# Altium project CMSIS-DAP_11U37_V100.PrjPCB
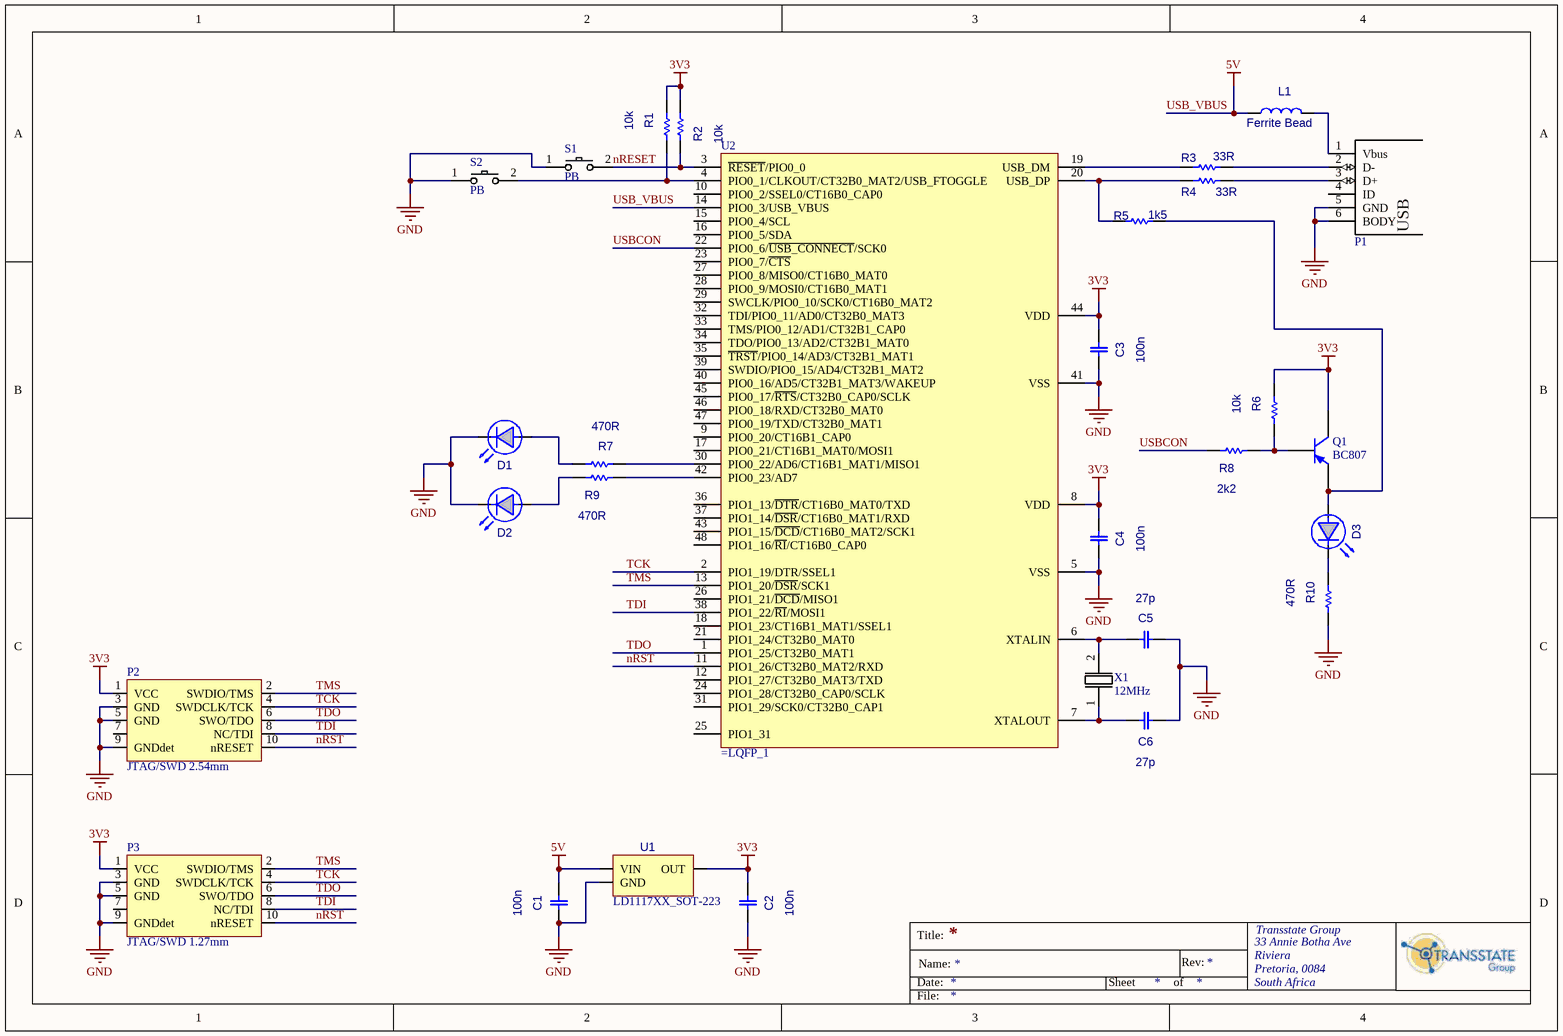
[diagram p0: CMSIS-DAP_11U37_V100.SchDoc]
1 sheet, 29 parts. Net scope: global (net labels, ports and power ports of the same name join across sheets).
Board file: CMSIS-DAP_11U37_V100.PcbDoc

## Sheet CMSIS-DAP_11U37_V100.SchDoc
size A4; Organization: Transstate Group; Address1: 33 Annie Botha ave; Address2: Riviera; Address3: Pretoria; Address4: 0084

### Parts
C1  100n  [CAP 0603]
C2  100n  [CAP 0603]
C3  100n  [CAP 0603]
C4  100n  [CAP 0603]
C5  27p  [CAP 0603]
C6  27p  [CAP 0603]
D1  LED  [LED 0603]  (value not drawn)
D2  LED  [LED 0603]  (value not drawn)
D3  LED  [LED 0603]  (value not drawn)
L1  Ferrite Bead  [IND 0603]
P1  USB MICRO-B  [USB - MICRO-B SMD]  (value not drawn)
P2  JTAG/SWD 2.54mm  [Header IDC Box 10w 2.54mm]
P3  JTAG/SWD 1.27mm  [Header 10W /2 1.27mm Shrouded]
Q1  BC807  [SOT-23]
R1  10k  [RES 0603]
R2  10k  [RES 0603]
R3  33R  [RES 0603]
R4  33R  [RES 0603]
R5  1k5  [RES 0603]
R6  10k  [RES 0603]
R7  470R  [RES 0603]
R8  2k2  [RES 0603]
R9  470R  [RES 0603]
R10  470R  [RES 0603]
S1  PB  [Push Button Omron SPST]
S2  PB  [Push Button Omron SPST]
U1  Code4: LD1117XX_SOT-223  [SOT-223]  (hidden comment: {Value})
U2  (no value)  [LQFP-48]
X1  12MHz  [Crystal SMU4]

### Nets
3V3: C2.1 C3.1 C4.1 P2.1(VCC) P3.1(VCC) Q1.3(C) R1.2 R2.1 R6.2 U1.3(OUT) U2.8(VDD) U2.44(VDD)
GND: C1.1 C2.2 C3.2 C4.2 C5.2 C6.1 D1.2 D2.2 P1.5(GND) P1.6(BODY) P2.3(GND) P2.5(GND) P2.9(GNDdet) P3.3(GND) P3.5(GND) P3.9(GNDdet) R10.1 S1.1 S2.1 U1.2(GND) U2.5(VSS) U2.41(VSS)
USB_VBUS: C1.2 L1.1 U1.1(VIN) U2.14(PIO0_3/USB_VBUS)  [also labelled 5V]
nRESET: R2.2 S1.2 U2.3(~{RESET}/PIO0_0)
nRST: P2.10(nRESET) P3.10(nRESET) U2.11(PIO1_26/CT32B0_MAT2/RXD)
TCK: P2.4(SWDCLK/TCK) P3.4(SWDCLK/TCK) U2.2(PIO1_19/DTR/SSEL1)
TDI: P2.8(NC/TDI) P3.8(NC/TDI) U2.38(PIO1_22/~{RI}/MOSI1)
TDO: P2.6(SWO/TDO) P3.6(SWO/TDO) U2.1(PIO1_25/CT32B0_MAT1)
TMS: P2.2(SWDIO/TMS) P3.2(SWDIO/TMS) U2.13(PIO1_20/~{DSR}/SCK1)
USBCON: R8.2 U2.22(PIO0_6/~{USB_CONNECT}/SCK0)
NetC5_1: C5.1 U2.6(XTALIN) X1.2
NetC6_2: C6.2 U2.7(XTALOUT) X1.1
NetD1_1: D1.1 R7.1
NetD2_1: D2.1 R9.2
NetD3_1: D3.1 Q1.2(E) R5.1
NetD3_2: D3.2 R10.2
NetL1_2: L1.2 P1.1(Vbus)
NetP1_2: P1.2(D-) R3.2
NetP1_3: P1.3(D+) R4.1
NetQ1_1: Q1.1(B) R6.1 R8.1
NetR1_1: R1.1 S2.2 U2.4(PIO0_1/CLKOUT/CT32B0_MAT2/USB_FTOGGLE)
NetR3_1: R3.1 U2.19(USB_DM)
NetR4_2: R4.2 R5.2 U2.20(USB_DP)
NetR7_2: R7.2 U2.30(PIO0_22/AD6/CT16B1_MAT1/MISO1)
NetR9_1: R9.1 U2.42(PIO0_23/AD7)

Not connected (* = marked no-connect by the designer): P1 4(ID); P2 7; P3 7; U2 9(PIO0_20/CT16B1_CAP0) 10(PIO0_2/SSEL0/CT16B0_CAP0) 12(PIO1_27/CT32B0_MAT3/TXD) 15(PIO0_4/SCL) 16(PIO0_5/SDA) 17(PIO0_21/CT16B1_MAT0/MOSI1) 18(PIO1_23/CT16B1_MAT1/SSEL1) 21(PIO1_24/CT32B0_MAT0) 23(PIO0_7/~{CTS}) 24(PIO1_28/CT32B0_CAP0/SCLK) 25(PIO1_31) 26(PIO1_21/~{DCD}/MISO1) 27(PIO0_8/MISO0/CT16B0_MAT0) 28(PIO0_9/MOSI0/CT16B0_MAT1) 29(SWCLK/PIO0_10/SCK0/CT16B0_MAT2) 31(PIO1_29/SCK0/CT32B0_CAP1) 32(TDI/PIO0_11/AD0/CT32B0_MAT3) 33(TMS/PIO0_12/AD1/CT32B1_CAP0) 34(TDO/PIO0_13/AD2/CT32B1_MAT0) 35(~{TRST}/PIO0_14/AD3/CT32B1_MAT1) 36(PIO1_13/~{DTR}/CT16B0_MAT0/TXD) 37(PIO1_14/~{DSR}/CT16B0_MAT1/RXD) 39(SWDIO/PIO0_15/AD4/CT32B1_MAT2) 40(PIO0_16/AD5/CT32B1_MAT3/WAKEUP) 43(PIO1_15/~{DCD}/CT16B0_MAT2/SCK1) 45(PIO0_17/~{RTS}/CT32B0_CAP0/SCLK) 46(PIO0_18/RXD/CT32B0_MAT0) 47(PIO0_19/TXD/CT32B0_MAT1) 48(PIO1_16/~{RI}/CT16B0_CAP0)

### Notes on the sheet
- Title:
- Date:
- Name:
- Sheet
- of
- Rev:
- 33 Annie Botha Ave
- Riviera
- Pretoria, 0084
- South Africa
- Transstate Group
- File:
- (in symbol USB MICRO-B) USB

### Library data of the parts
C1-C6 = Capacitor Ceramic
  C1-C4: Value: 100n
  C5 C6: Value: 27p
L1 = Inductor: Value: Ferrite Bead
P2 P3 = CONN - 10W JTAG/SWD
Q1 = Transistor PNP: PNP Bipolar Transistor; Comp1: BC807
R1-R10 = Resistor
  R1 R2 R6: Value: 10k
  R3 R4: Value: 33R
  R5: Value: 1k5
  R7 R9 R10: Value: 470R
  R8: Value: 2k2
S1 S2 = Push Button SPST
U1 = Regulator Positive: pin to pad: 1>3 2>1 3>2; Code: LD29080XX; Code2: MC78M00/MC78M00A; Code3: ST L78xx; Value: {Value}
U2 = LPC11Uxx-48: 32-bit ARM Cortex-M0 microcontroller; up to 128 kB flash; up  to 12 kB SRAM and 4 kB EEPROM; USB device; USART; Value: LPC11Uxx-48
X1 = Crystal: Value: 12MHz